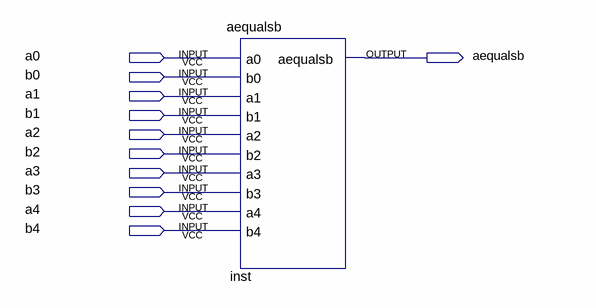
[diagram p0: schematic sheet]
// Quartus schematic 5bitsAequalsB.bdf as structural Verilog: 1 symbols, 11 pins
module \5bitsAequalsB  (
  input  a0,
  input  b0,
  input  a1,
  input  b1,
  input  a2,
  input  b2,
  input  a3,
  input  b3,
  input  a4,
  input  b4,
  output aequalsb
);

  aequalsb inst (
    .a0(a0), .b0(b0), .a1(a1), .b1(b1), .a2(a2), .b2(b2), .a3(a3), .b3(b3), .a4(a4), .b4(b4),
    .aequalsb(aequalsb));
endmodule
